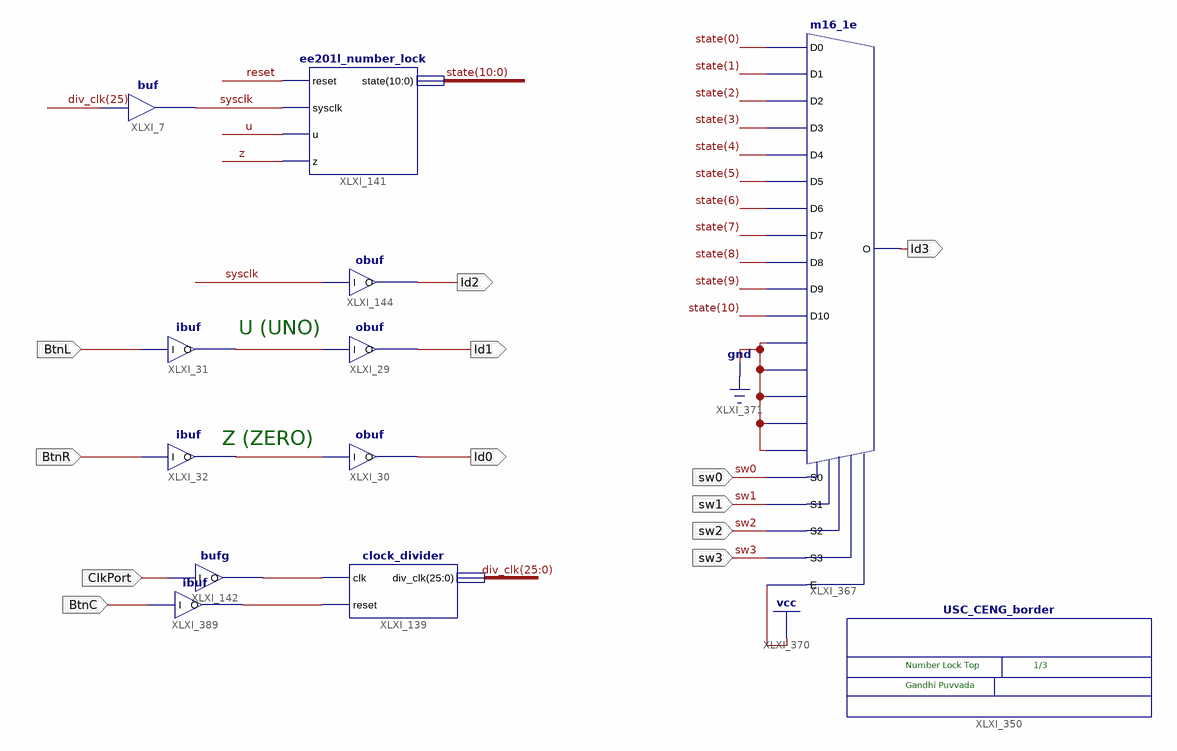
[diagram p0: schematic sheet 1]
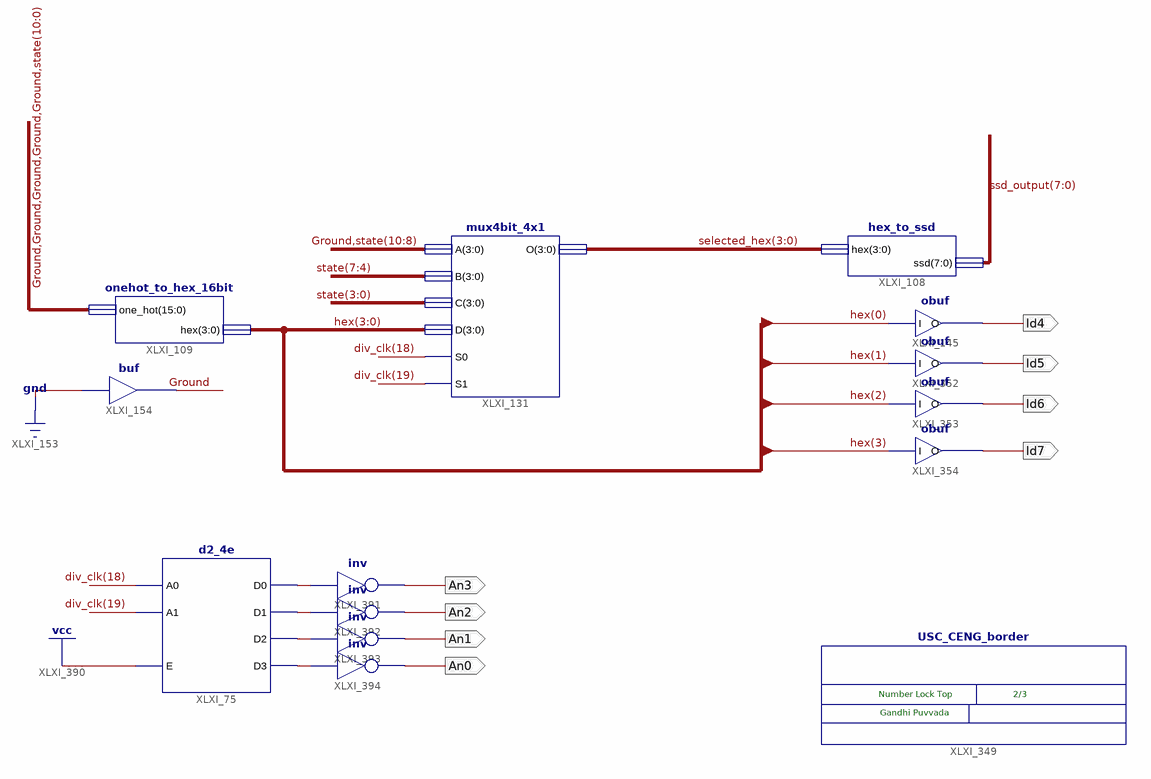
[diagram p1: schematic sheet 2]
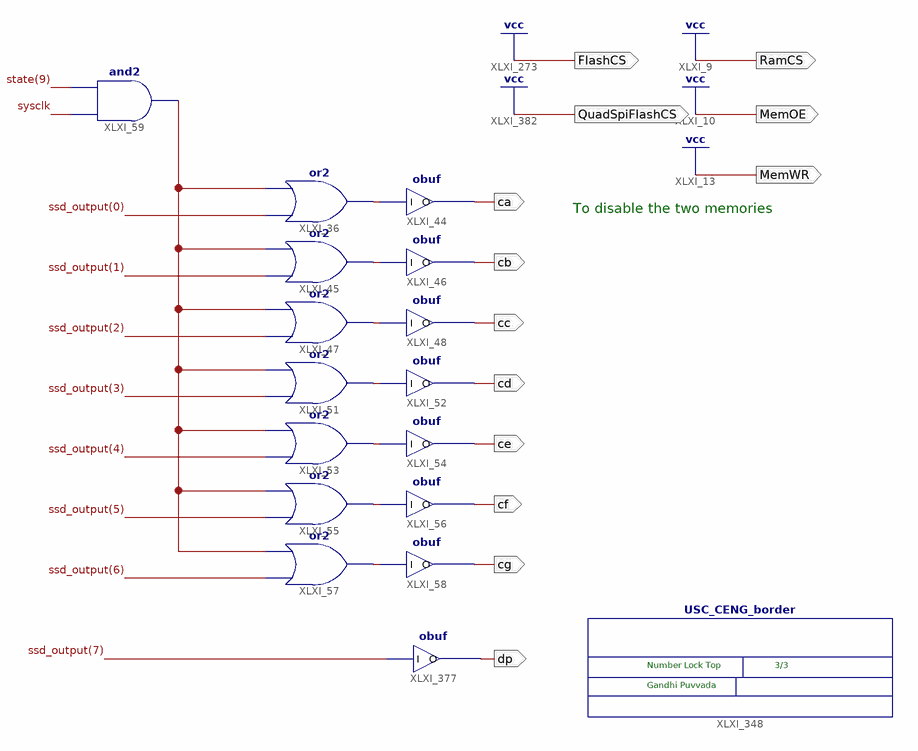
[diagram p2: schematic sheet 3]
// Xilinx ISE schematic ee201l_number_lock_top.sch (spartan6) as structural Verilog: 43 symbols, 33 ports
module ee201l_number_lock_top (
  input  BtnL,
  input  ClkPort,
  input  BtnC,
  input  sw3,
  input  sw2,
  input  sw1,
  input  sw0,
  input  BtnR,
  output ld1,
  output ld0,
  output cg,
  output cf,
  output ce,
  output cd,
  output cc,
  output cb,
  output ca,
  output ld2,
  output ld3,
  output dp,
  output ld4,
  output ld5,
  output ld6,
  output ld7,
  output RamCS,
  output MemOE,
  output MemWR,
  output FlashCS,
  output QuadSpiFlashCS,
  output An2,
  output An3,
  output An1,
  output An0
);

  wire Ground, reset, sysclk, u, XLXN_71, XLXN_87, XLXN_91, XLXN_99, XLXN_103, XLXN_107, XLXN_111, XLXN_198,
       XLXN_695, XLXN_782, XLXN_783, XLXN_784, XLXN_785, z;
  wire [3:0] hex, selected_hex;
  wire [7:0] ssd_output;
  wire [10:0] state;
  wire [25:0] div_clk;

  obuf XLXI_144 (.I(sysclk), .O(ld2));
  obuf XLXI_29 (.I(u), .O(ld1));
  ibuf XLXI_31 (.I(BtnL), .O(u));
  obuf XLXI_30 (.I(z), .O(ld0));
  ibuf XLXI_32 (.I(BtnR), .O(z));
  bufg XLXI_142 (.I(ClkPort), .O(XLXN_198));
  obuf XLXI_58 (.I(XLXN_111), .O(cg));
  obuf XLXI_56 (.I(XLXN_107), .O(cf));
  obuf XLXI_54 (.I(XLXN_103), .O(ce));
  obuf XLXI_52 (.I(XLXN_99), .O(cd));
  obuf XLXI_48 (.I(XLXN_91), .O(cc));
  obuf XLXI_46 (.I(XLXN_87), .O(cb));
  obuf XLXI_44 (.I(XLXN_71), .O(ca));
  or XLXI_57 (XLXN_111, ssd_output[6], XLXN_695);
  or XLXI_55 (XLXN_107, ssd_output[5], XLXN_695);
  or XLXI_53 (XLXN_103, ssd_output[4], XLXN_695);
  or XLXI_51 (XLXN_99, ssd_output[3], XLXN_695);
  or XLXI_47 (XLXN_91, ssd_output[2], XLXN_695);
  or XLXI_45 (XLXN_87, ssd_output[1], XLXN_695);
  or XLXI_36 (XLXN_71, ssd_output[0], XLXN_695);
  USC_CENG_border XLXI_348 ();
  USC_CENG_border XLXI_349 ();
  USC_CENG_border XLXI_350 ();
  m16_1e XLXI_367 (
    .D0(state[0]), .D1(state[1]), .D10(state[10]), .D11(1'b0), .D12(1'b0), .D13(1'b0), .D14(1'b0),
    .D15(1'b0), .D2(state[2]), .D3(state[3]), .D4(state[4]), .D5(state[5]), .D6(state[6]), .D7(state[7]),
    .D8(state[8]), .D9(state[9]), .E(1'b1), .S0(sw0), .S1(sw1), .S2(sw2), .S3(sw3), .O(ld3));
  obuf XLXI_377 (.I(ssd_output[7]), .O(dp));
  buf XLXI_154 (Ground, 1'b0);
  onehot_to_hex_16bit XLXI_109 (.hex(hex), .one_hot({{5{Ground}}, state}));
  mux4bit_4x1 XLXI_131 (
    .A({Ground, state[10:8]}), .B(state[7:4]), .C(state[3:0]), .D(hex), .S0(div_clk[18]), .S1(div_clk[19]),
    .O(selected_hex));
  hex_to_ssd XLXI_108 (.ssd(ssd_output), .hex(selected_hex));
  obuf XLXI_145 (.I(hex[0]), .O(ld4));
  obuf XLXI_352 (.I(hex[1]), .O(ld5));
  obuf XLXI_353 (.I(hex[2]), .O(ld6));
  obuf XLXI_354 (.I(hex[3]), .O(ld7));
  d2_4e XLXI_75 (
    .A0(div_clk[18]), .A1(div_clk[19]), .E(1'b1), .D0(XLXN_782), .D1(XLXN_783), .D2(XLXN_784), .D3(XLXN_785));
  and XLXI_59 (XLXN_695, sysclk, state[9]);
  ibuf XLXI_389 (.I(BtnC), .O(reset));
  buf XLXI_7 (sysclk, div_clk[25]);
  clock_divider XLXI_139 (.clk(XLXN_198), .reset(reset), .div_clk(div_clk));
  ee201l_number_lock XLXI_141 (.reset(reset), .sysclk(sysclk), .u(u), .z(z), .state(state));
  not XLXI_391 (An3, XLXN_782);
  not XLXI_392 (An2, XLXN_783);
  not XLXI_393 (An1, XLXN_784);
  not XLXI_394 (An0, XLXN_785);

  assign FlashCS = 1'b1;
  assign MemOE = 1'b1;
  assign MemWR = 1'b1;
  assign QuadSpiFlashCS = 1'b1;
  assign RamCS = 1'b1;

  // Notes on the sheet:
  //   U (UNO)
  //   Z (ZERO)
  //   Number Lock Top
  //   1/3
  //   Gandhi Puvvada
  //   Number Lock Top
  //   2/3
  //   Gandhi Puvvada
  //   To disable the two memories
  //   Number Lock Top
  //   3/3
  //   Gandhi Puvvada
endmodule
